# Altium schematic sheet HB_mini_testJig_schematic.SchDoc
size A2; SheetNumber: 1; SheetTotal: 1
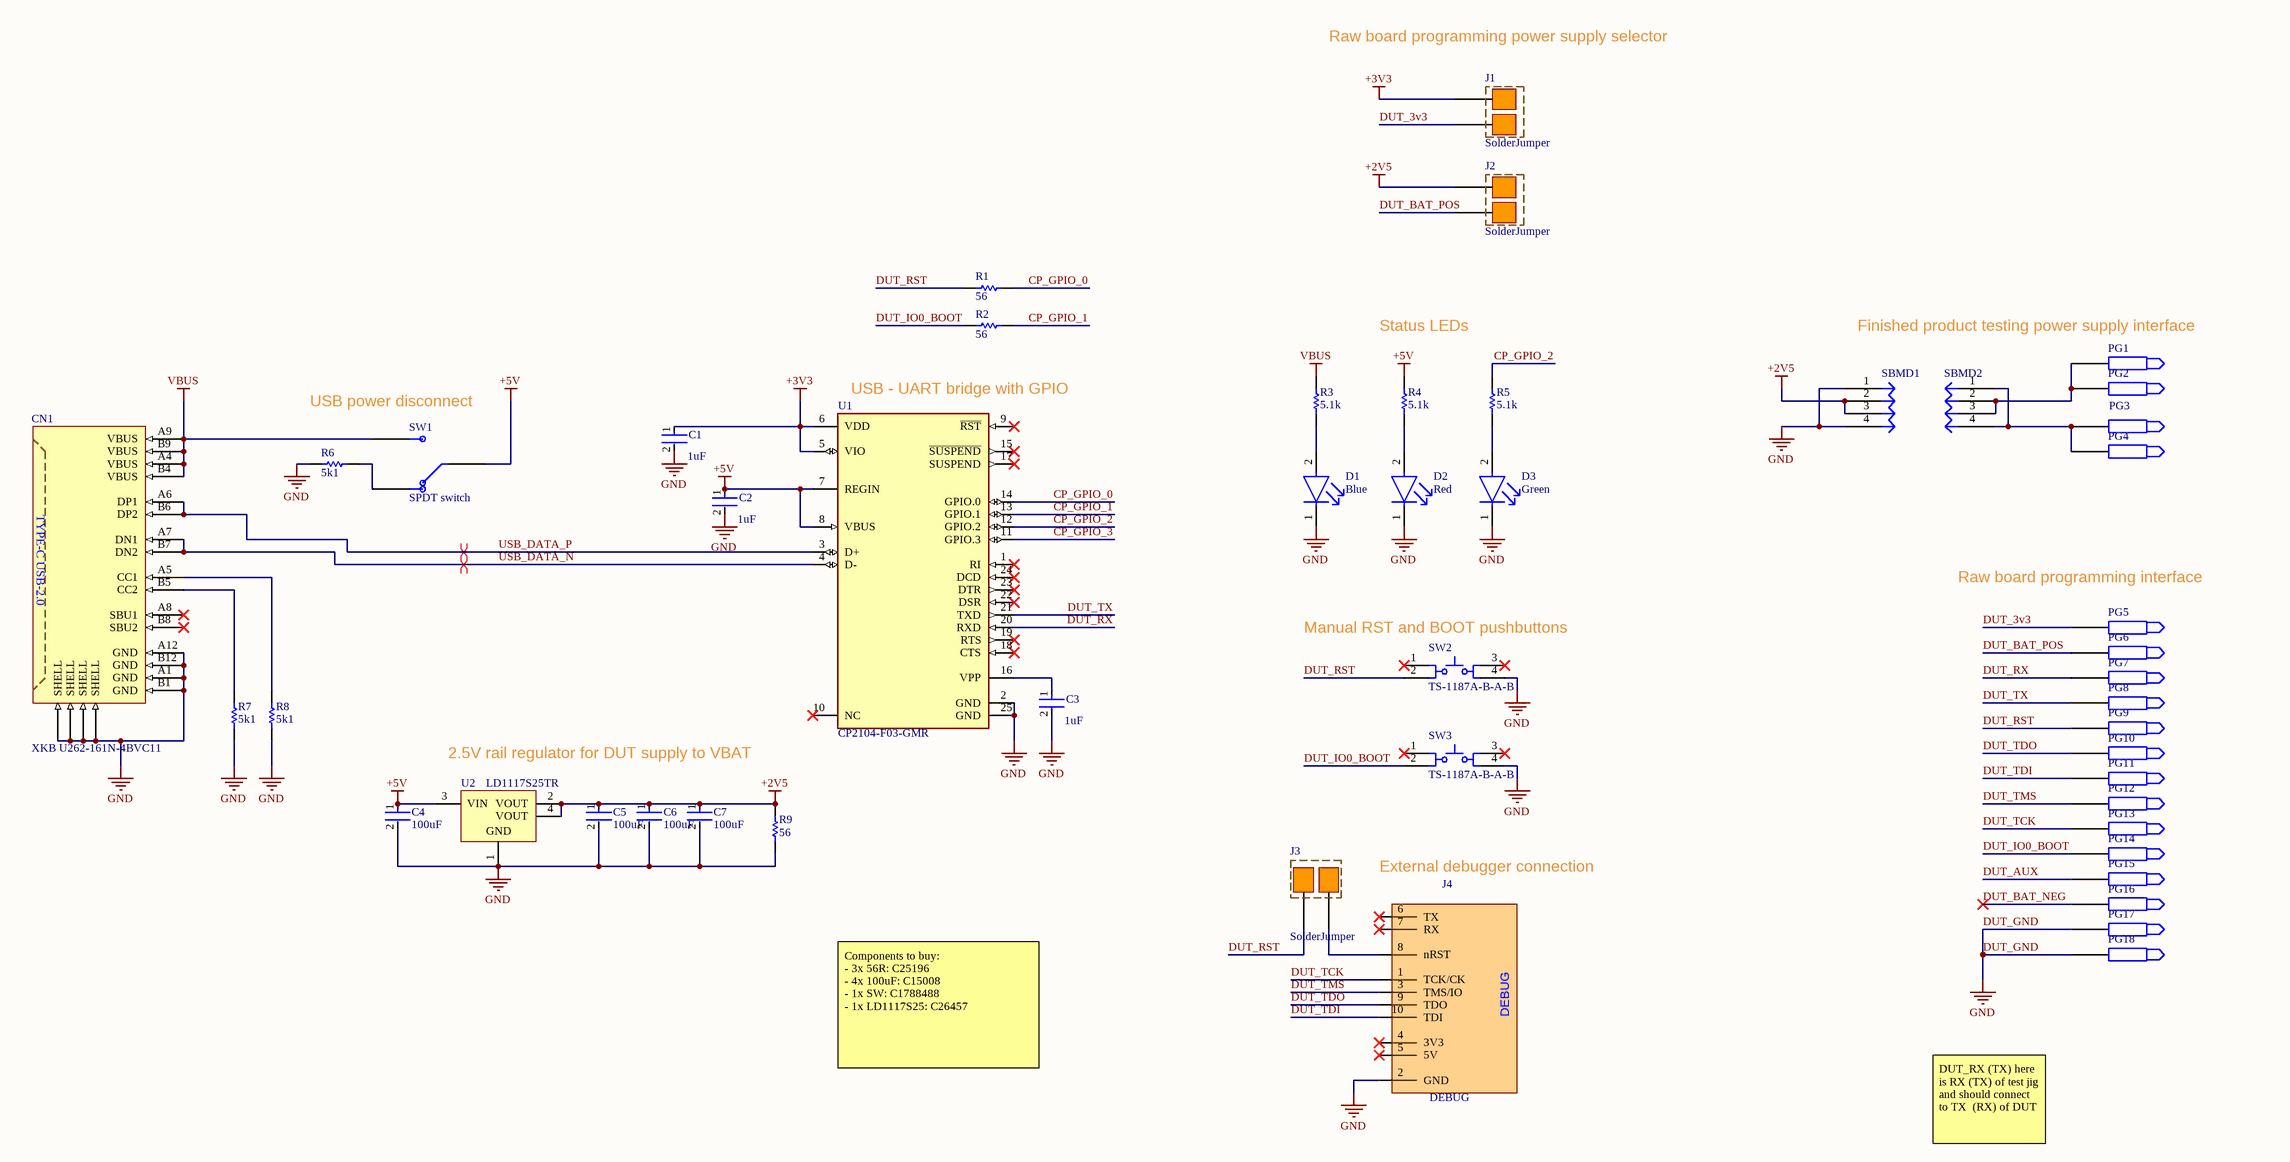
[diagram p0: HB_mini_testJig_schematic.SchDoc]

## Parts
C1  value 1uF  [FP-CL10B105KO8NNNC-IPC_B]  (hidden comment: CL10A105KB8NNNC)
C2  value 1uF  [FP-CL10B105KO8NNNC-IPC_B]  (hidden comment: CL10A105KB8NNNC)
C3  value 1uF  [FP-CL10B105KO8NNNC-IPC_B]  (hidden comment: CL10A105KB8NNNC)
C4  Capacitance: 100uF  [FP-CL32-IPC_A]  (hidden comment: CL32A107MQVNNWE)
C5  Capacitance: 100uF  [FP-CL32-IPC_A]  (hidden comment: CL32A107MQVNNWE)
C6  Capacitance: 100uF  [FP-CL32-IPC_A]  (hidden comment: CL32A107MQVNNWE)
C7  Capacitance: 100uF  [FP-CL32-IPC_A]  (hidden comment: CL32A107MQVNNWE)
CN1  XKB U262-161N-4BVC11  [XKB U262-161N-4BVC11]
D1  Color: Blue  [FP-150080SS75000-MFG]  (hidden comment: 150080SS75000)
D2  Color: Red  [FP-150080SS75000-MFG]  (hidden comment: 150080SS75000)
D3  Color: Green  [FP-150080SS75000-MFG]  (hidden comment: 150080SS75000)
J1  SolderJumper  [AislerRule_SolderJumper_1mm]
J2  SolderJumper  [AislerRule_SolderJumper_1mm]
J3  SolderJumper  [AislerRule_SolderJumper_1mm]
J4  DEBUG  [muselab cmsis-dap frictionfit]
PG1  POGO pin  [1x16x3mm (diam, total len, travel) pogo pin - HORIZONTAL]  (value not drawn)
PG2  POGO pin  [1x16x3mm (diam, total len, travel) pogo pin - HORIZONTAL]  (value not drawn)
PG3  POGO pin  [1x16x3mm (diam, total len, travel) pogo pin - HORIZONTAL]  (value not drawn)
PG4  POGO pin  [1x16x3mm (diam, total len, travel) pogo pin - HORIZONTAL]  (value not drawn)
PG5  POGO pin  [1x16x3mm (diam, total len, travel) pogo pin]  (value not drawn)
PG6  POGO pin  [1x16x3mm (diam, total len, travel) pogo pin]  (value not drawn)
PG7  POGO pin  [1x16x3mm (diam, total len, travel) pogo pin]  (value not drawn)
PG8  POGO pin  [1x16x3mm (diam, total len, travel) pogo pin]  (value not drawn)
PG9  POGO pin  [1x16x3mm (diam, total len, travel) pogo pin]  (value not drawn)
PG10  POGO pin  [1x16x3mm (diam, total len, travel) pogo pin]  (value not drawn)
PG11  POGO pin  [1x16x3mm (diam, total len, travel) pogo pin]  (value not drawn)
PG12  POGO pin  [1x16x3mm (diam, total len, travel) pogo pin]  (value not drawn)
PG13  POGO pin  [1x16x3mm (diam, total len, travel) pogo pin]  (value not drawn)
PG14  POGO pin  [1x16x3mm (diam, total len, travel) pogo pin]  (value not drawn)
PG15  POGO pin  [1x16x3mm (diam, total len, travel) pogo pin]  (value not drawn)
PG16  POGO pin  [1x16x3mm (diam, total len, travel) pogo pin]  (value not drawn)
PG17  POGO pin  [1x16x3mm (diam, total len, travel) pogo pin]  (value not drawn)
PG18  POGO pin  [1x16x3mm (diam, total len, travel) pogo pin]  (value not drawn)
R1  value 56  [RESC1608X55X30NL15T15]  (hidden comment: 0603WAF560JT5E)
R2  value 56  [RESC1608X55X30NL15T15]  (hidden comment: 0603WAF560JT5E)
R3  value 5.1k  [RESC1608X55X30NL15T15]  (hidden comment: 0603WAF5101T5E)
R4  value 5.1k  [RESC1608X55X30NL15T15]  (hidden comment: 0603WAF5101T5E)
R5  value 5.1k  [RESC1608X55X30NL15T15]  (hidden comment: 0603WAF5101T5E)
R6  value 5k1  [RESC1608X55X30NL15T15]  (hidden comment: 0603WAF5101T5E)
R7  value 5k1  [RESC1608X55X30NL15T15]  (hidden comment: 0603WAF5101T5E)
R8  value 5k1  [RESC1608X55X30NL15T15]  (hidden comment: 0603WAF5101T5E)
R9  value 56  [RESC1608X55X30NL15T15]  (hidden comment: 0603WAF560JT5E)
SBMD1  vertical module board 4 pin  [vertical submodule board female]  (value not drawn)
SBMD2  vertical module board 4 pin  [vertical submodule pcb male]  (value not drawn)
SW1  SPDT switch  [ST-0-103-A01-T000-RS+PJ toggle switch]
SW2  TS-1187A-B-A-B  [ESWI-TL3342F160QG_V]
SW3  TS-1187A-B-A-B  [ESWI-TL3342F160QG_V]
U1  CP2104-F03-GMR  [FP-CP2104-F03-GMR-IPC_A]
U2  LD1117S25TR  [SOT-223_L]

## Nets
+2V5: C5.1 C6.1 C7.1 J2.1 R9.2 SBMD1.2 SBMD1.3 U2.2(VOUT) U2.4(VOUT)
+3V3: C1.1 J1.1 U1.5(VIO) U1.6(VDD)
+5V: C2.1 C4.1 R4.2 SW1.2 U1.7(REGIN) U1.8(VBUS) U2.3(VIN)
DUT_GND: C1.2 C2.2 C3.2 C4.2 C5.2 C6.2 C7.2 CN1.A1(GND) CN1.A12(GND) CN1.B1(GND) CN1.B12(GND) CN1.SHELL1(SHELL) CN1.SHELL2(SHELL) CN1.SHELL3(SHELL) CN1.SHELL4(SHELL) D1.1(C) D2.1(C) D3.1(C) J4.2(GND) PG17.1 PG18.1 R6.2 R7.1 R8.1 R9.1 SBMD1.1 SBMD1.4 SW2.4 SW3.4 U1.2(GND) U1.25(GND) U2.1(GND)  [also labelled GND]
VBUS: CN1.A4(VBUS) CN1.A9(VBUS) CN1.B4(VBUS) CN1.B9(VBUS) R3.2 SW1.3
CP_GPIO_0: R1.1 U1.14(GPIO.0)
CP_GPIO_1: R2.1 U1.13(GPIO.1)
CP_GPIO_2: R5.2 U1.12(GPIO.2)
CP_GPIO_3: U1.11(GPIO.3)
DUT_3v3: J1.2 PG5.1
DUT_AUX: PG15.1
DUT_BAT_NEG: PG16.1
DUT_BAT_POS: J2.2 PG6.1
DUT_IO0_BOOT: PG14.1 R2.2 SW3.2
DUT_RST: J3.1 PG9.1 R1.2 SW2.2
DUT_RX: PG7.1 U1.20(RXD)
DUT_TCK: J4.1(TCK/CK) PG13.1
DUT_TDI: J4.10(TDI) PG11.1
DUT_TDO: J4.9(TDO) PG10.1
DUT_TMS: J4.3(TMS/IO) PG12.1
DUT_TX: PG8.1 U1.21(TXD)
USB_DATA_N: CN1.A7(DN1) CN1.B7(DN2) U1.4(D-)
USB_DATA_P: CN1.A6(DP1) CN1.B6(DP2) U1.3(D+)
NetC3_1: C3.1 U1.16(VPP)
NetCN1_A5: CN1.A5(CC1) R8.2
NetCN1_B5: CN1.B5(CC2) R7.2
NetD1_2: D1.2(A) R3.1
NetD2_2: D2.2(A) R4.1
NetD3_2: D3.2(A) R5.1
NetJ3_2: J3.2 J4.8(nRST)
NetPG1_1: PG1.1 PG2.1 SBMD2.2 SBMD2.3
NetPG3_1: PG3.1 PG4.1 SBMD2.1 SBMD2.4
NetR6_1: R6.1 SW1.1

Not connected (* = marked no-connect by the designer): CN1 A8(SBU1)* B8(SBU2)*; J4 4(3V3)* 5(5V)* 6(TX)* 7(RX)*; SW2 1* 3*; SW3 1* 3*; U1 1(RI)* 9(~{RST})* 10(NC)* 15(~{SUSPEND})* 17(SUSPEND)* 18(CTS)* 19(RTS)* 22(DSR)* 23(DTR)* 24(DCD)*

## Layout directives
differential pair: USB_DATA_N, USB_DATA_P

## Notes on the sheet
- Raw board programming power supply selector
- Status LEDs
- (near PG1) Finished product testing power supply interface
- (near SW1) USB power disconnect
- (near U1) USB - UART bridge with GPIO
- (near PG5) Raw board programming interface
- (near SW2) Manual RST and BOOT pushbuttons
- 2.5V rail regulator for DUT supply to VBAT
- External debugger connection
- Components to buy:
  - 3x 56R: C25196
  - 4x 100uF: C15008
  - 1x SW: C1788488
  - 1x LD1117S25: C26457
- DUT_RX (TX) here is RX (TX) of test jig and should connect to TX  (RX) of DUT
- (in symbol XKB U262-161N-4BVC11) TYPE-C USB-2.0

## Library data of the parts
C1-C3 = CMP-2000-06093-2: CAP CER 1UF 50V X5R 0603; Manufacturer: Samsung Electro-Mechanics America, Inc; Manufacturer Part Number: CL10B105KO8NNNC; Temperature Coefficient: 15%; Material: Ceramic; Tolerance: 10%; Voltage Rating: 50V; Automotive: No; ComponentLink2Description: Datasheet; Device Class L3: Ceramic Capacitors; Capacitance: 1uF; Temperature Characteristic: X5R; Temperature Range High: +125°C; Digikey Description: CAP CER 1UF 16V X7R 0603; Device Class L2: Capacitors; Octopart: https://octopart.com/cl10b105ko8nnnc-samsung-19018973; ComponentLink2URL: http://www.samsungsem.com/global/front/downloadcms.do?path=%2F%2Fglobal%2F%2Fsupport%2F%2Fproduct-search%2F%2Fmlcc%2F%2F__icsFiles%2F%2Fafieldfile%2F%2F2019%2F%2F06%2F%2F18&fileName=CL10B105KO8NNNC-19.pdf; Lead Free: Yes; Height: 0.9mm; Package: CL10B105KO8NNNC; Temperature Range Low: -55°C; Device Class L1: Passive Components; RoHS: TRUE; Temperature: -55°C to +125°C; Category: Cap; Ipc Land Pattern Name: CAPC16080X80; LCSC: C15849
C4-C7 = CMP-13271-000832-1: Cap Ceramic 100uF 6.3V X5R ±20% SMD 1210 +85°C Embossed T/R; Max Operating Temperature: 85°C; Tolerance: 20%; Packaging: Cut Tape; Dielectric: X5R; Contact Plating: Tin; Thickness: 0.11inch; Mount: Surface Mount; Length: 0.126inch; Package Quantity: 1; Case Code (Metric): 3225; Voltage Rating: 6.3V; Case/Package: 1210; Case Code (Imperial): 1210; Width: 0.098inch; Min Operating Temperature: -55°C; Termination: Wraparound; LCSC: C15008
CN1 = XKB U262-161N-4BVC11: USB Type-C connector, USB-2.0, 16 pins; LCSC: C319148
D1-D3 = CMP-1426-00010-2: LED RED CLEAR 0805 SMD; Forward Voltage: 1.9V; Luminous Intensity: 60mcd; Dominant Wavelength: 630nm; Forward Current: 30mA; Viewing Angle: 140°; Lens Color: Colorless; Test Current: 20mA; Lens Size: 1.25mm; Packaging: Cut Tape; Width: 1.25mm; Case Code (Metric): 2012; Max Operating Temperature: 85°C; RoHS Compliant: Yes; Mount: Surface Mount; Case/Package: 0805; Series: WL-SMCW; Length: 2mm; Case Code (Imperial): 0805; Wavelength: 630nm; Lens Style: Clear; Min Operating Temperature: -40°C; Lens Transparency: Clear; Package Quantity: 1; Height: 0.8mm
J4 = MuseLab CMSIS-DAP probe receiving connector
PG1-PG18 = POGO pin: Random Aliexpress pogo pin, 1mm diameter, 16mm extended length, 3mm travel
R1 R2 R9 = CMP-2000-00540-1: Part Number: 0603WAF5101T5E; Manufacturer: UNI_ROYAL; LCSC: C25196
R3-R8 = CMP-2000-00540-1: Manufacturer: UNI_ROYAL; Part Number: 0603WAF5101T5E; LCSC: C23186
SW2 SW3 = CMP-1696-00003-1: XKB TS-1187A-B-A-B C318884; LCSC: C318884
U1 = CMP-08107-000004-1: IC SGL USB-TO-UART BRIDGE 24QFN; Manufacturer: Silicon Laboratories; Max Supply Voltage: 3.6V; Min Supply Voltage: 1.8V; Nominal Supply Current: 100-17000uA; Standoff Height: 0mm; Interface: UART,USB; Temperature Range Low: -40°C; Lead Free: Yes; Device Class L3: Controllers; Ambient Temperature Range Low: -55°C; Automotive: No; Category: IC; Temperature: -40°C to +85°C; Octopart: https://octopart.com/cp2104-f03-gmr-silicon+labs-19668642; Ambient Temperature Range High: +125°C; Package: CP2104-F03-GMR; Device Class L2: Interface ICs; Digikey Description: IC SGL USB-TO-UART BRIDGE 24QFN; Device Class L1: Integrated Circuits (ICs); Manufacturer Part Number: CP2104-F03-GMR; Temperature Range High: +85°C; ComponentLink2URL: https://www.silabs.com/documents/public/data-sheets/cp2104.pdf; Height: 0.8mm; Ipc Land Pattern Name: QFN50P400X400X75-24; Mouser Description: I/O Controller Interface IC USB to UART bridge; ComponentLink2Description: Datasheet; RoHS: TRUE; LCSC: C47742
U2 = CMP-0244-00306-1: Fixed Low Drop Positive Voltage Regulator, 4-Pin SOT-223, Tape and Reel; ComponentLink2URL: http://www.st.com/internet/com/TECHNICAL_RESOURCES/TECHNICAL_LITERATURE/DATASHEET/CD00000544.pdf; ComponentLink1URL: http://www.st.com; PackageVersion: 2010; DatasheetVersion: 1/11/2011; PackageDescription: 4-Pin SOT-223 Package, 6.5 x 3.5 mm Body, 2.3 mm Pitch, 7 mm Lead Span; ComponentLink1Description: Manufacturer URL; PackageReference: SOT-223; ComponentLink2Description: Datasheet; LCSC: C26457
SW1 = SPDT switch: LCSC: C1788488